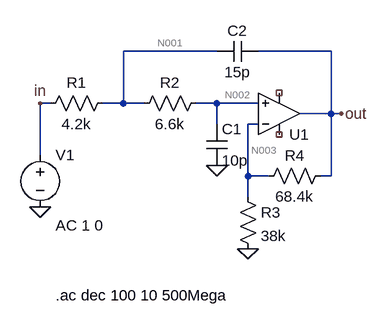
[diagram p0: schematic 1.asc]
1.asc, the LTspice schematic file:
Version 4
SHEET 1 880 680
WIRE 304 48 160 48
WIRE 480 48 368 48
WIRE 48 128 32 128
WIRE 160 128 160 48
WIRE 160 128 128 128
WIRE 192 128 160 128
WIRE 304 128 272 128
WIRE 368 128 304 128
WIRE 480 144 480 48
WIRE 480 144 432 144
WIRE 496 144 480 144
WIRE 304 160 304 128
WIRE 368 160 352 160
WIRE 32 208 32 128
WIRE 352 240 352 160
WIRE 384 240 352 240
WIRE 480 240 480 144
WIRE 480 240 464 240
WIRE 352 272 352 240
FLAG 304 224 0
FLAG 352 352 0
FLAG 32 128 in
FLAG 496 144 out
FLAG 32 288 0
SYMBOL res 144 112 R90
WINDOW 0 0 56 VBottom 2
WINDOW 3 32 56 VTop 2
SYMATTR InstName R1
SYMATTR Value 4.2k
SYMBOL res 288 112 R90
WINDOW 0 0 56 VBottom 2
WINDOW 3 32 56 VTop 2
SYMATTR InstName R2
SYMATTR Value 6.6k
SYMBOL cap 288 160 R0
SYMATTR InstName C1
SYMATTR Value 10p
SYMBOL res 336 256 R0
SYMATTR InstName R3
SYMATTR Value 38k
SYMBOL res 480 224 R90
WINDOW 0 0 56 VBottom 2
WINDOW 3 32 56 VTop 2
SYMATTR InstName R4
SYMATTR Value 68.4k
SYMBOL cap 368 32 R90
WINDOW 0 0 32 VBottom 2
WINDOW 3 32 32 VTop 2
SYMATTR InstName C2
SYMATTR Value 15p
SYMBOL voltage 32 192 R0
WINDOW 123 24 124 Left 2
WINDOW 39 0 0 Left 0
SYMATTR InstName V1
SYMATTR Value ""
SYMATTR Value2 AC 1 0
SYMBOL OpAmps\\UniversalOpAmp1 400 144 M180
SYMATTR InstName U1
TEXT 56 424 Left 2 !.ac dec 100 10 500Mega

The netlist it stands for:
* 1.asc
R1 N001 in 4.2k
R2 N002 N001 6.6k
C1 N002 0 10p
R3 N003 0 38k
R4 out N003 68.4k
C2 out N001 15p
V1 in 0 AC 1 0
XU1 N002 N003 NC_01 NC_02 out level1 Avol=1Meg GBW=10Meg Vos=0 En=0 Enk=0 In=0 Ink=0 Rin=500Meg  ; pins In+ In- V+ V- OUT
.ac dec 100 10 500Mega
.lib UniversalOpAmp1.lib
.backanno
.end

* Results of the author's LTspice run, read from the files saved beside the schematic
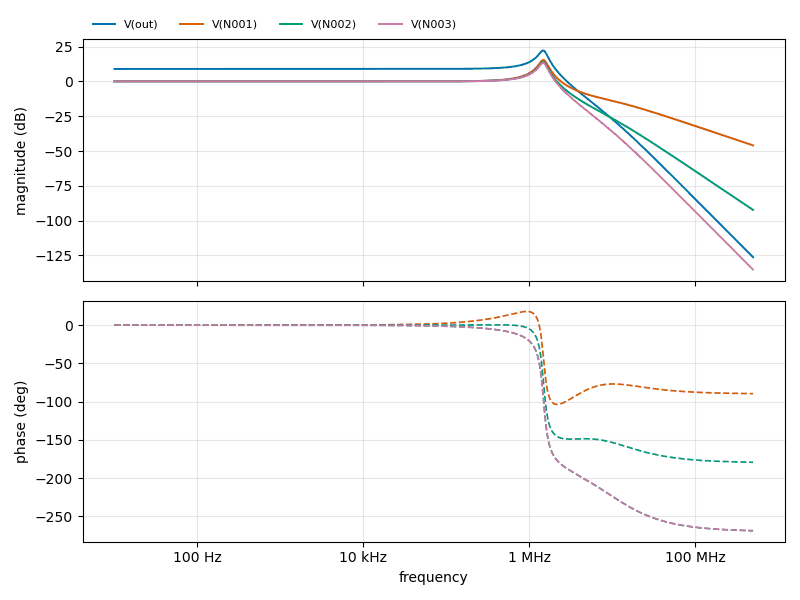
[diagram p1: AC Analysis of 1.asc, plotted from the saved traces]
* AC Analysis, 1 run:
*   V(out): 8.94 dB at 10 Hz, -126.24 dB at 500 MHz, peak 22.26 dB at 1.479 MHz, 3 dB below the peak at 1.301 MHz and 1.625 MHz
*   V(N001): 0.00 dB at 10 Hz, -45.93 dB at 500 MHz, peak 15.39 dB at 1.479 MHz, 3 dB below the peak at 1.317 MHz and 1.639 MHz
*   V(N002): 0.00 dB at 10 Hz, -92.27 dB at 500 MHz, peak 14.00 dB at 1.479 MHz, 3 dB below the peak at 1.307 MHz and 1.63 MHz
*   V(N003): -0.00 dB at 10 Hz, -135.19 dB at 500 MHz, peak 13.31 dB at 1.479 MHz, 3 dB below the peak at 1.301 MHz and 1.625 MHz